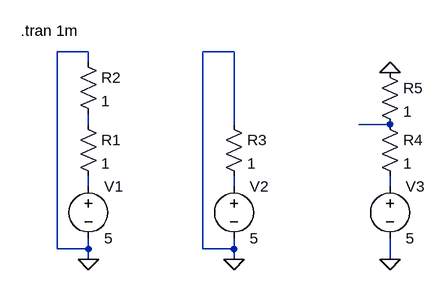
[diagram p0: schematic Draft1.asc]
Draft1.asc, the LTspice schematic file:
Version 4
SHEET 1 880 680
WIRE 224 176 176 176
WIRE 448 176 400 176
WIRE 224 192 224 176
WIRE 224 288 224 272
WIRE 448 288 448 176
WIRE 688 288 640 288
WIRE 224 384 224 368
WIRE 448 384 448 368
WIRE 688 384 688 368
WIRE 176 480 176 176
WIRE 224 480 224 464
WIRE 224 480 176 480
WIRE 400 480 400 176
WIRE 448 480 448 464
WIRE 448 480 400 480
WIRE 688 496 688 464
WIRE 224 496 224 480
WIRE 448 496 448 480
FLAG 224 496 0
FLAG 448 496 0
FLAG 688 496 0
FLAG 688 208 0
SYMBOL res 208 272 R0
SYMATTR InstName R1
SYMATTR Value 1
SYMBOL voltage 224 368 R0
SYMATTR InstName V1
SYMATTR Value 5
SYMBOL res 208 176 R0
SYMATTR InstName R2
SYMATTR Value 1
SYMBOL res 432 272 R0
SYMATTR InstName R3
SYMATTR Value 1
SYMBOL voltage 448 368 R0
SYMATTR InstName V2
SYMATTR Value 5
SYMBOL res 672 272 R0
SYMATTR InstName R4
SYMATTR Value 1
SYMBOL voltage 688 368 R0
SYMATTR InstName V3
SYMATTR Value 5
SYMBOL res 672 192 R0
SYMATTR InstName R5
SYMATTR Value 1
TEXT 120 144 Left 2 !.tran 1m

The netlist it stands for:
* Draft1.asc
R1 N001 N003 1
V1 N003 0 5
R2 0 N001 1
R3 0 N004 1
V2 N004 0 5
R4 N002 N005 1
V3 N005 0 5
R5 0 N002 1
.tran 1m
.backanno
.end